# Altium schematic sheet 08_AuxConnectors.SchDoc: Aux Connectors
size A4; SheetNumber: 9; SheetTotal: 10
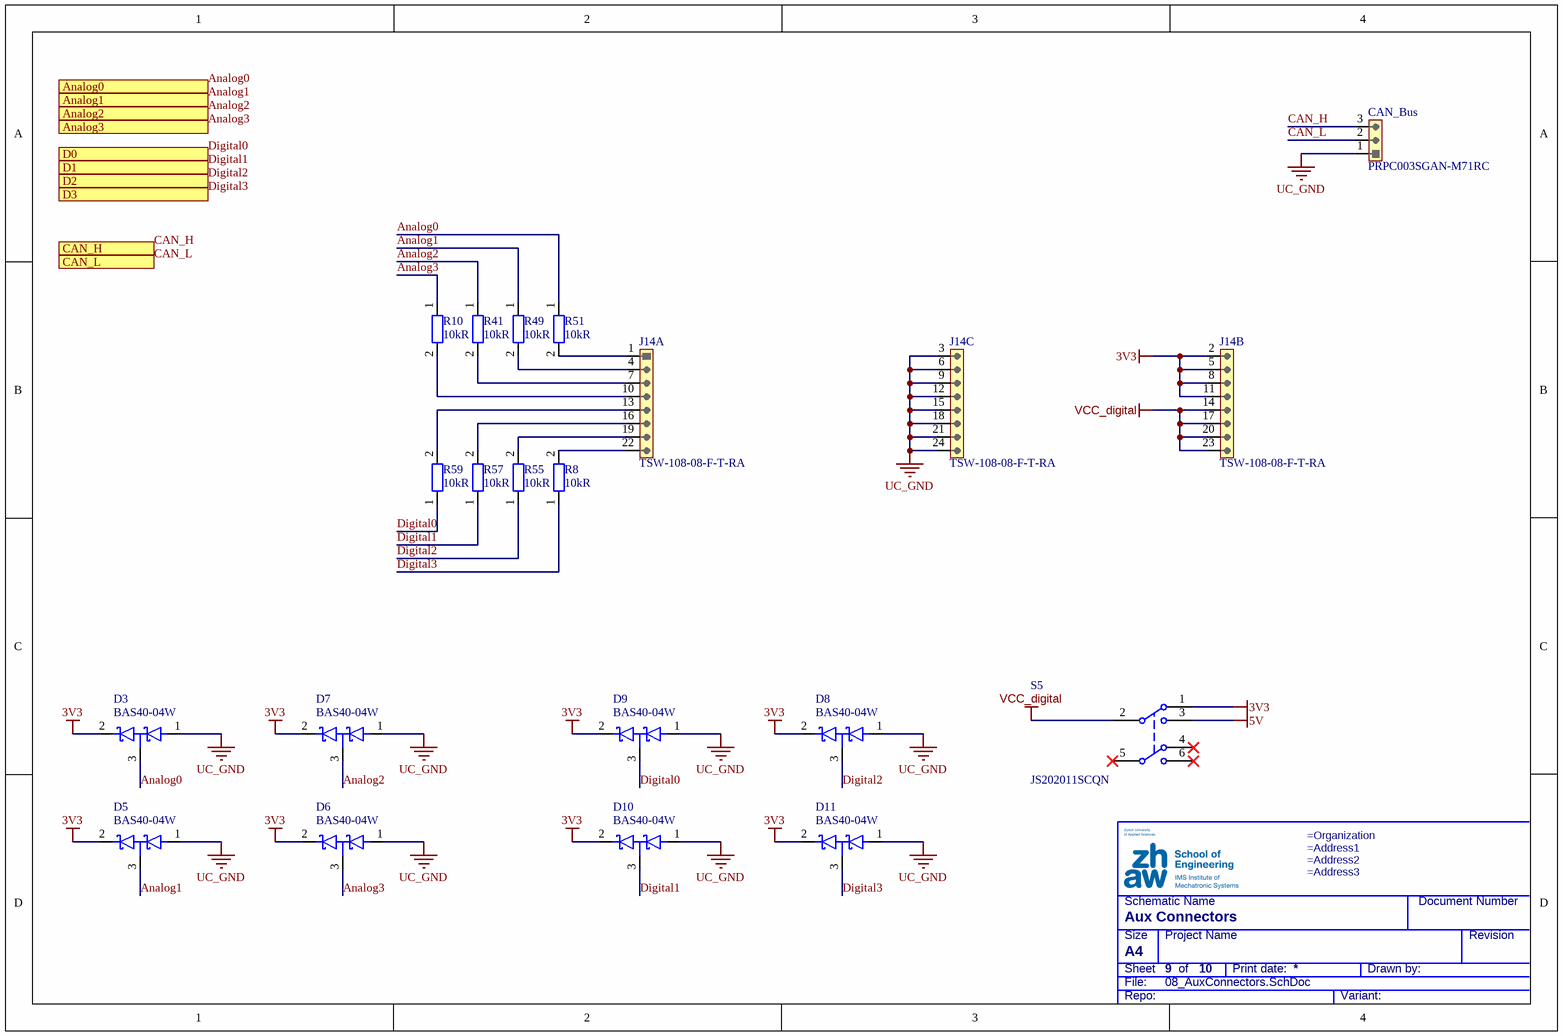
[diagram p0: 08_AuxConnectors.SchDoc]

## Parts
CAN_Bus  PRPC003SGAN-M71RC  [HD254_1x3_MH]
D3  BAS40-04W  [SOT65P220X110-3L]
D5  BAS40-04W  [SOT65P220X110-3L]
D6  BAS40-04W  [SOT65P220X110-3L]
D7  BAS40-04W  [SOT65P220X110-3L]
D8  BAS40-04W  [SOT65P220X110-3L]
D9  BAS40-04W  [SOT65P220X110-3L]
D10  BAS40-04W  [SOT65P220X110-3L]
D11  BAS40-04W  [SOT65P220X110-3L]
J14  TSW-108-08-F-T-RA  [HD254_8x3_MH]  (parts A,B,C of 3)
R8  10kR  [RESC1005X04L]
R10  10kR  [RESC1005X04L]
R41  10kR  [RESC1005X04L]
R49  10kR  [RESC1005X04L]
R51  10kR  [RESC1005X04L]
R55  10kR  [RESC1005X04L]
R57  10kR  [RESC1005X04L]
R59  10kR  [RESC1005X04L]
S5  JS202011SCQN  [SW_JS202011SCQN]

## Ports
Analog0, Analog1, Analog2, Analog3, CAN_H (in), CAN_L (in), D0, D1, D2, D3

## Nets
3V3: D3.2(K) D5.2(K) D6.2(K) D7.2(K) D8.2(K) D9.2(K) D10.2(K) D11.2(K) J14.2 J14.5 J14.8 J14.11 S5.1
5V: S5.3
UC_GND: CAN_Bus.1 D3.1(A) D5.1(A) D6.1(A) D7.1(A) D8.1(A) D9.1(A) D10.1(A) D11.1(A) J14.3 J14.6 J14.9 J14.12 J14.15 J14.18 J14.21 J14.24
VCC_digital: J14.14 J14.17 J14.20 J14.23 S5.2
Analog0: D3.3(C) R51.1 ; port Analog0
Analog1: D5.3(C) R49.1 ; port Analog1
Analog2: D7.3(C) R41.1 ; port Analog2
Analog3: D6.3(C) R10.1 ; port Analog3
CAN_H: CAN_Bus.3 ; port CAN_H
CAN_L: CAN_Bus.2 ; port CAN_L
Digital0: D9.3(C) R59.1 ; port D0
Digital1: D10.3(C) R57.1 ; port D1
Digital2: D8.3(C) R55.1 ; port D2
Digital3: D11.3(C) R8.1 ; port D3
NetJ14_1: J14.1 R51.2
NetJ14_4: J14.4 R49.2
NetJ14_7: J14.7 R41.2
NetJ14_10: J14.10 R10.2
NetJ14_13: J14.13 R59.2
NetJ14_16: J14.16 R57.2
NetJ14_19: J14.19 R55.2
NetJ14_22: J14.22 R8.2

Not connected (* = marked no-connect by the designer): S5 4* 5* 6*

## Notes on the sheet
- Schematic Name
- Document Number
- File:
- Sheet
- Size
- A4
- Project Name
- of
- Print date:
- Drawn by:
- Revision
- Repo:
- Variant:

## Library data of the parts
CAN_Bus = CMP-002-00172-16: Header, 1x3Pin, Pitch 2.54mm, Male, Horizontal, THT; Manufacturer: Sullins Connector Solutions; Designator: CON; Mating Length: 8.08m; Overall Contact Length: 0mm; Pin Mapping: 1x3; Angle: Horizontal; Gender: Male; Insulation Height: 2.5mm; Mounting Technology: THT; Pins: 3; Pitch: 2.54mm; Pitch Row: 2.54mm; Termination Length: 3.05mm
D3 D5-D11 = CMP-004-00045-16: Schottky Diode, 40V, 120mA, SOT323, 2 in series; Case/Package: SC-70 / SOT-323-3; Connection: 2 in series; Current: 120mA; Mounting Technology: SMD; Type: Schottky; Voltage: 40V
J14 = CMP-00368-4: Header, 3x8Pin, Pitch 2.54mm, Male, Horizontal, THT; Manufacturer: Samtec; Plating: Gold; Mating Length: 5.84mm; Pin Mapping: 3x6; Pitch: 2.54mm; Angle: Horizontal; Gender: Male; Pitch Row: 2.54mm; Pins: 18; Mounting Technology: Board; Insulation Height: 2.54mm; Termination Length: 2.29mm
R8 R10 R41 R49 R51 R55 R57 R59 = CMP-009-00149-32: Res, 10kR, 1%, 0.1W, 0402; Value: 10k; Power: 100mW; Voltage Rating: 50V; Case/Package: 0402; Case Code (Metric): 1005; Mounting Technology: SMD; Tolerance: 1%; Type: Fixed
S5 = CMP-011-00022-7: Slide Switch, Vertical, DPDT, 30V, 100mA, L9B3H3.5; Illuminated: No; Actuation: Slide; Angle: Vertical; Contact Form: DPDT; Contact Material: Copper Alloy; Current Rating: 100mA; Mounting Technology: SMD; Size: L9B3H3.5; Type: Switch; Voltage Rating: 30V